# Altium schematic sheet 1_ADC.schdoc
size 309 x 223 mm; Symbol: Sheet-Symbol_A4; Device: Sheet-Symbol_A4; Company: EasyEDA.com; Drawed: EasyEDA Pro; Reviewed: EasyEDA Pro; Version: V0.1; Page Size: A4; @Project Name: Scanning Tunneling Microscope; @Page Count: 3; @Update Date: 2023-05-15; @Create Date: 2023-04-30; @Schematic Name: Controller; Part Number: JLCPCB-002; @Page No: 2; @Page Name: ADC
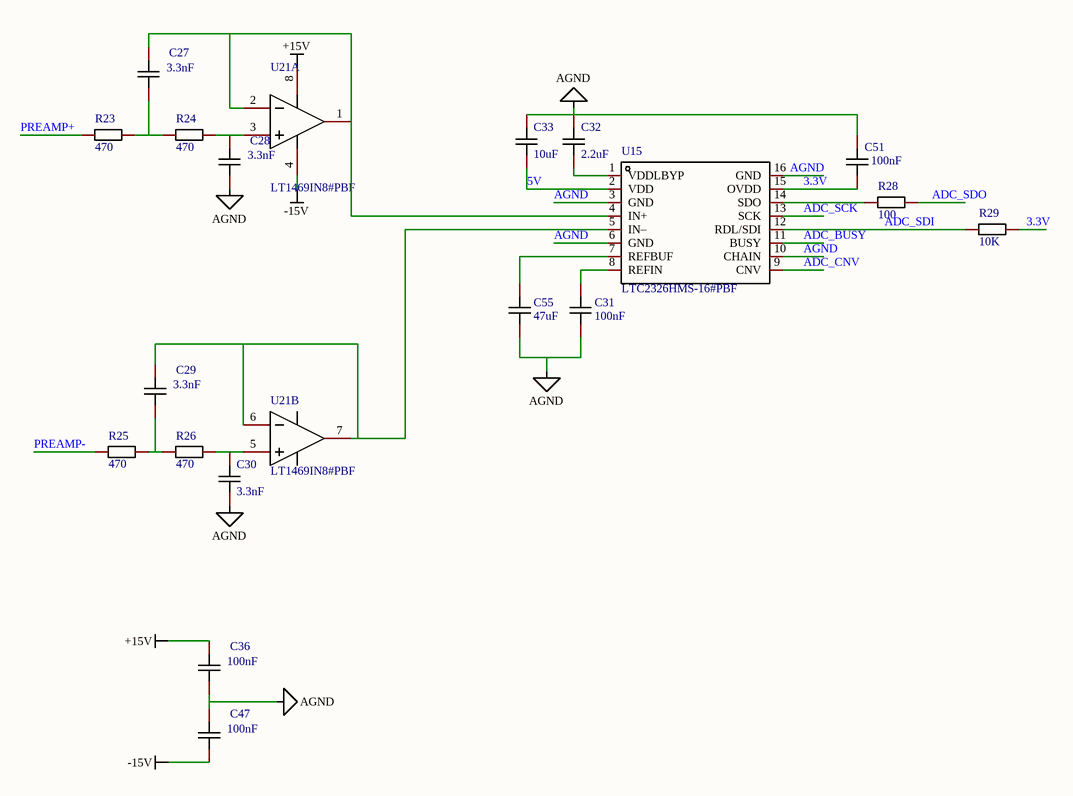
[diagram p0: 1_ADC.schdoc]

## Parts
C27  value 3.3nF  [C0603]  (hidden comment: CL10B104KA8NNNC)
C28  value 3.3nF  [C0603]  (hidden comment: CL10B104KA8NNNC)
C29  value 3.3nF  [C0603]  (hidden comment: CL10B104KA8NNNC)
C30  value 3.3nF  [C0603]  (hidden comment: CL10B104KA8NNNC)
C31  value 100nF  [C0603]  (hidden comment: CL10B104KA8NNNC)
C32  value 2.2uF  [C0603]  (hidden comment: CL10B104KA8NNNC)
C33  value 10uF  [C0603]  (hidden comment: CL10B104KA8NNNC)
C36  value 100nF  [C0603]  (hidden comment: CL10B104KA8NNNC)
C47  value 100nF  [C0603]  (hidden comment: CL10B104KA8NNNC)
C51  value 100nF  [C0603]  (hidden comment: CL10B104KA8NNNC)
C55  47uF
R23  470
R24  470
R25  470
R26  470
R28  100  [R0603]
R29  10K  [R0603]
U15  LTC2326HMS-16#PBF  [MSOP-16_L4.0-W3.0-P0.50-LS4.9-BL]
U21  LT1469IN8#PBF  [PDIP-8_L10.2-W6.5-P2.54-LS7.6-BL]  (parts A,B of 2)

## Nets
+15V: C36.2 U21.8(V+)
-15V: C47.1 U21.4(V-)
AGND: C28.1 C30.1 C31.1 C32.2 C33.2 C36.1 C47.2 C51.2 C55.2 U15.3(GND) U15.6(GND) U15.10(CHAIN) U15.16(GND)
3.3V: C51.1 R29.2 U15.15(OVDD)
5V: C33.1 U15.2(VDD)
ADC_BUSY: U15.11(BUSY)
ADC_CNV: U15.9(CNV)
ADC_SCK: U15.13(SCK)
ADC_SDI: R29.1 U15.12(RDL/SDI)
ADC_SDO: R28.2
PREAMP+: R23.1
PREAMP-: R25.1
NetC27_1: C27.1 R23.2 R24.1
NetC27_2: C27.2 U15.4(IN+) U21.1(OUT_A) U21.2(-IN_A)
NetC28_2: C28.2 R24.2 U21.3(+IN_A)
NetC29_1: C29.1 R25.2 R26.1
NetC29_2: C29.2 U15.5(IN–) U21.6(-IN_B) U21.7(OUT_B)
NetC30_2: C30.2 R26.2 U21.5(+IN_B)
NetC31_2: C31.2 U15.8(REFIN)
NetC32_1: C32.1 U15.1(VDDLBYP)
NetC55_1: C55.1 U15.7(REFBUF)
NetR28_1: R28.1 U15.14(SDO)

## Notes on the sheet
- 1
- 2
- 3
- 4
- 5
- 6
- A
- B
- C
- Schematic
- Controller
- Create Date
- Update Date
- 2023-05-15
- 2023-04-30
- Reviewed
- Drawed
- Page
- EasyEDA Pro
- ADC
- Part Number
- Scanning Tunneling Microscope
- JLCPCB-002
- D
- VER
- SIZE
- PAGE
- OF
- V0.1
- A4
- EasyEDA.com

## Library data of the parts
C27-C33 C36 C47 C51 = CL10B104KA8NNNC: 容值:100nF;精度:±10%;额定电压:25V;温度系数:X7R;; Manufacturer: SAMSUNG(三星); Add into BOM: yes; Tolerance: ±10%; Voltage Rated: 25V; Temperature Coefficient: X7R; Symbol: CL10B104KA8NNNC; Device: CL10B104KA8NNNC; LCSC Part Name: 100nF ±10% 25V; Supplier Part: C1590; Manufacturer Part: CL10B104KA8NNNC; Supplier Footprint: 0603; JLCPCB Part Class: Extended Part; Datasheet: https://atta.szlcsc.com/upload/public/pdf/source/20160103/1457707680294.pdf; Supplier: LCSC; Convert to PCB: yes
C55 = CAP_1210: Add into BOM: yes; Name: 47uF; Symbol: CAP_1210; Device: CAP_1210; Convert to PCB: yes; Supplier Footprint: 0603; Value: 47uF
R23-R26 = 470: 电阻类型:厚膜电阻;阻值:10k;精度:±1%;功率:1/10W;温度系数:±100ppm/;最大工作电压:75V;工作温度范围:-55~+155;; Manufacturer: UniOhm; Manufacturer Part: 0603WAF4700T5E; Add into BOM: yes; Origin Footprint 2: R0603; Tolerance: ±1%; Power(Watts): 1/10W; Overload Voltage (Max): 75V; Name: 470; Symbol: 470; Device: 470; Convert to PCB: yes; Supplier: LCSC; Supplier Part: C23179; JLCPCB Part Class: Basic Part; Supplier Footprint: 0603; Datasheet: https://atta.szlcsc.com/upload/public/pdf/source/20200306/C422600_1E6D84923E4A46A82E41ADD87F860B5C.pdf; Type: 厚膜电阻; Value: 470; LCSC Part Name: 10k ±1%; Temperature Coefficient: ±100ppm/; Operating Temperature Range: -55~+155
R28 R29 = Res_0603: Symbol: Res; Convert to PCB: yes; Device: Res_0603; Add into BOM: yes; Supplier Footprint: 0603
  R28: Name: 100; Value: 100
  R29: Name: 10K; Value: 10K
U15 = LTC2326HMS-16#PBF: Number of Bits:- Sampling Rate (Per Second): Number of Inputs: Input Type: Data Interface: Voltage - Supply: Reference Type:; Manufacturer: ADI(亚德诺)/LINEAR; Add into BOM: yes; Name: LTC2326HMS-16#PBF; Symbol: LTC2326HMS-16#PBF; Device: LTC2326HMS-16#PBF; LCSC Part Name: LTC2326HMS-16#PBF; Supplier Part: C680097; Manufacturer Part: LTC2326HMS-16#PBF; Supplier Footprint: MSOP-16; JLCPCB Part Class: Extended Part; Datasheet: https://atta.szlcsc.com/upload/public/pdf/source/20200722/C680093_F51938300F9263EE407557258EE16CD8.pdf; Supplier: LCSC; Convert to PCB: yes; Number of Bits: -
U21 = LT1469IN8#PBF: Amplifier Type: Number of Circuits: -3db Bandwidth（G=1）:- Current - Input Bias（Ib）:- Voltage - Input Offset（Vos）:- Gain Bandwidth Product（GBP）: Slew Rate（SR）: Output Type: Supply Voltage（Single）: Iq per channel (Typ): Operating Temperature:; Manufacturer: ADI(亚德诺)/LINEAR; Add into BOM: yes; Name: LT1469IN8#PBF; Symbol: LT1469IN8#PBF; Device: LT1469IN8#PBF; LCSC Part Name: LT1469IN8#PBF; Supplier Part: C663979; Manufacturer Part: LT1469IN8#PBF; Supplier Footprint: PDIP-8; JLCPCB Part Class: Extended Part; Datasheet: https://atta.szlcsc.com/upload/public/pdf/source/20200713/C663973_E2E2AEA39F825CAB8624C89850E5F618.pdf; Supplier: LCSC; Convert to PCB: yes; -3db Bandwidth（G=1）: -; Current - Input Bias（Ib）: -; Voltage - Input Offset（Vos）: -